# Altium schematic sheet Converter_Unit.SchDoc
size A3
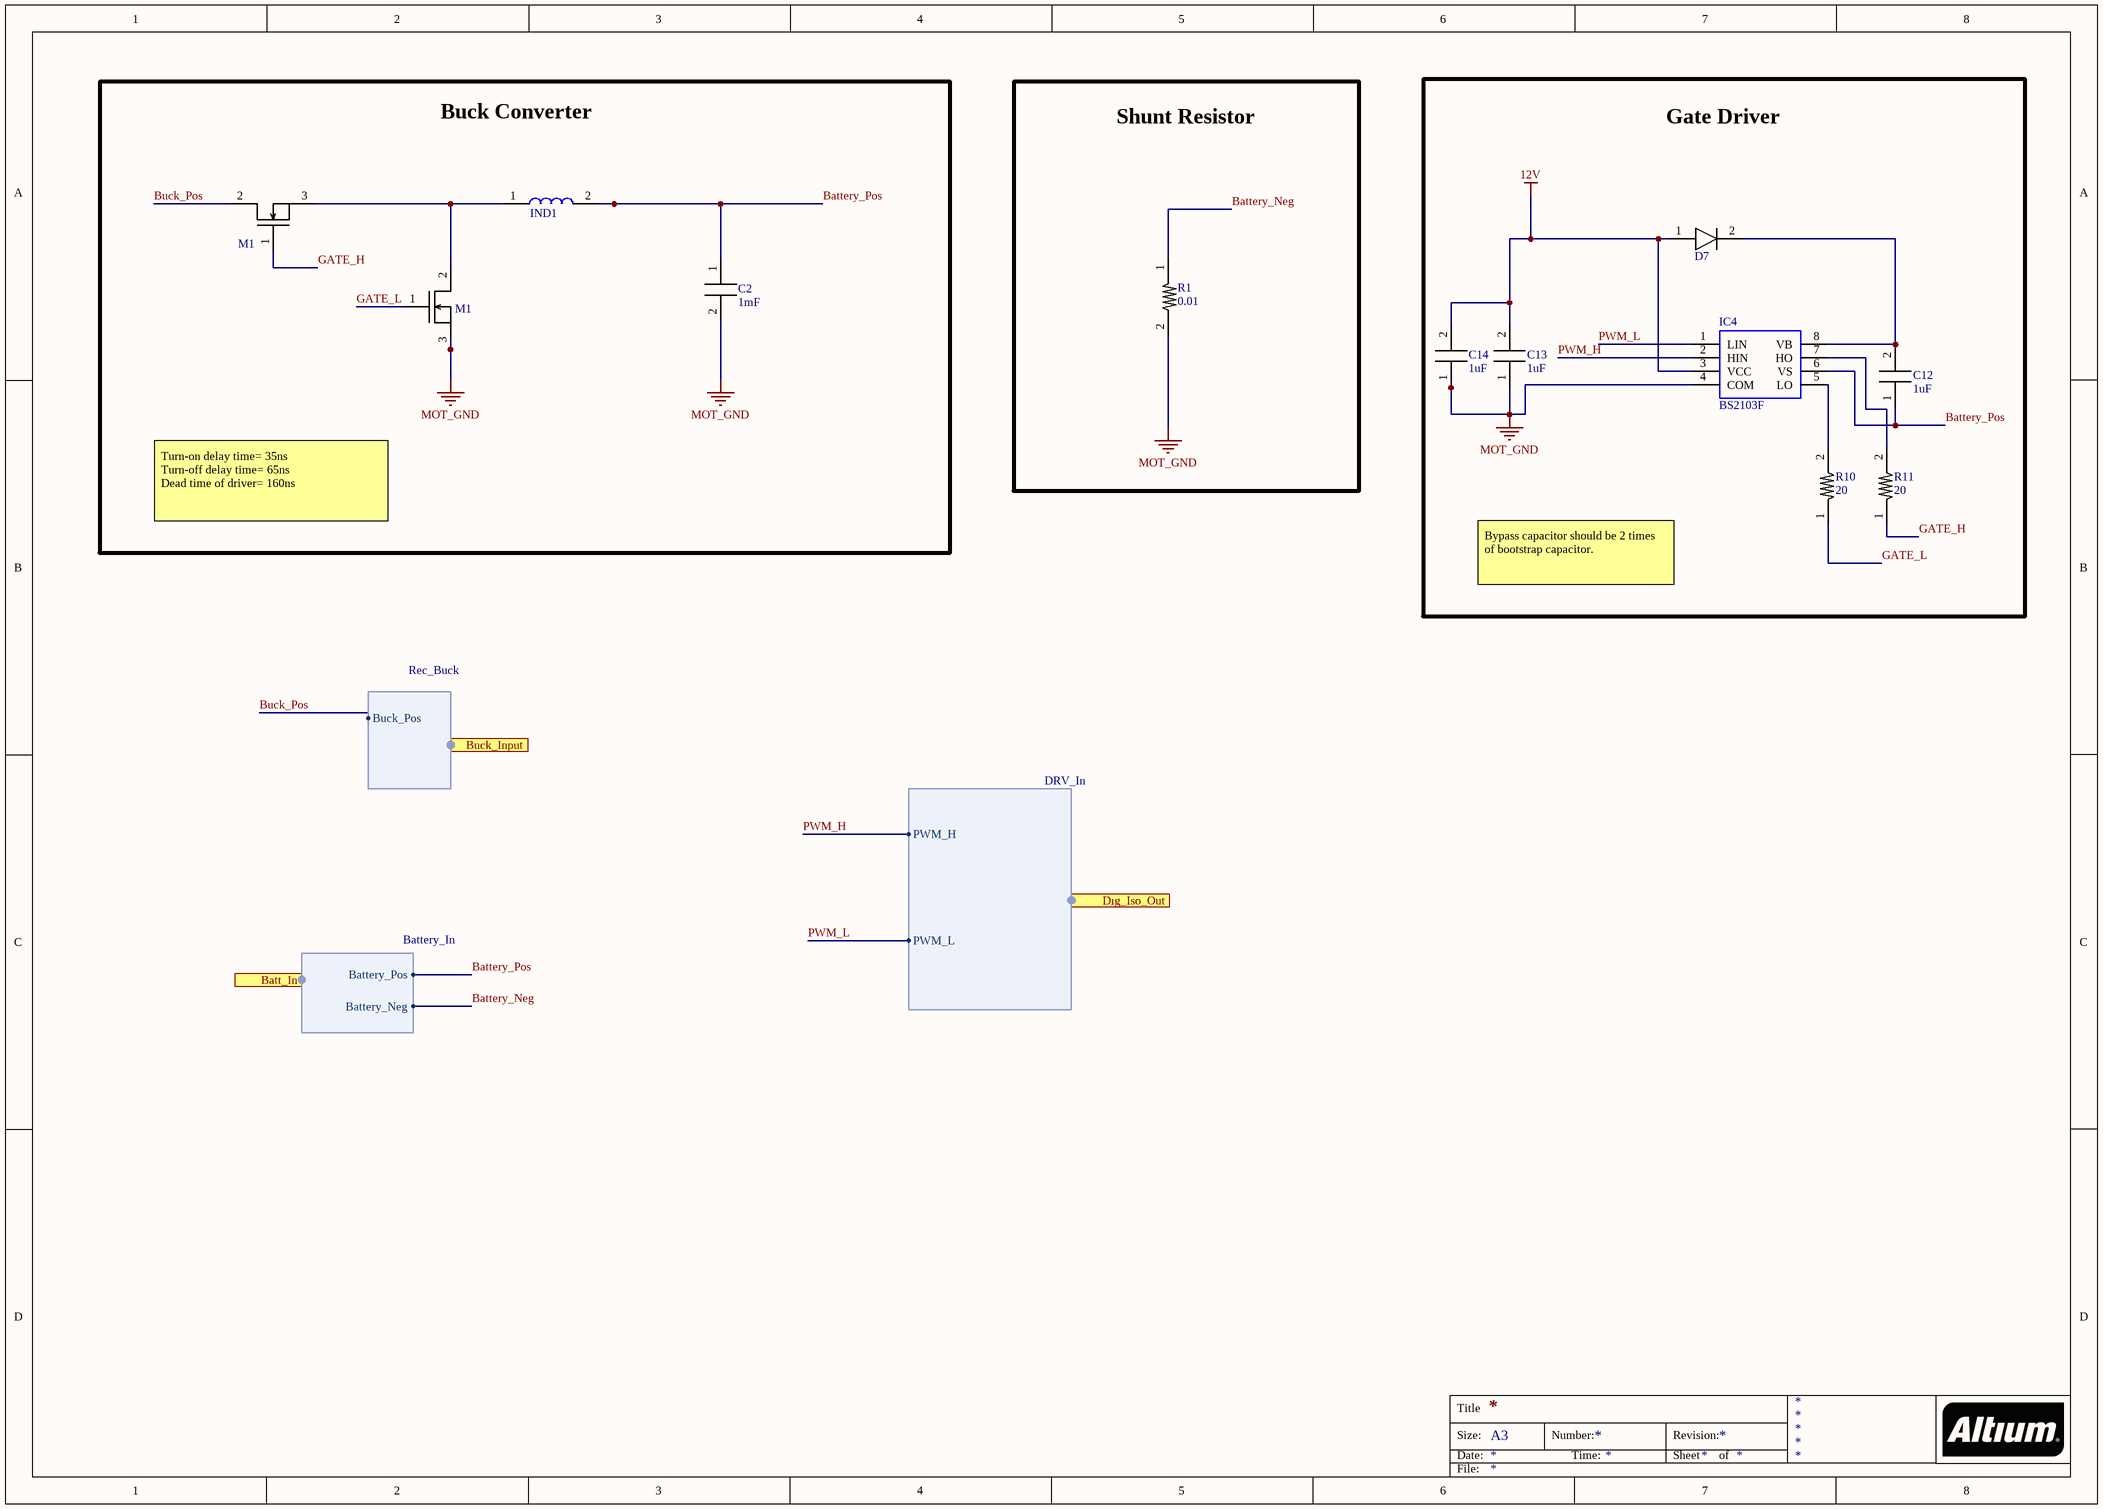
[diagram p0: Converter_Unit.SchDoc]

## Parts
*  M1
*?  M1
C2  Parameter 1: 1mF  (hidden comment: CAP 1mF UVK1V102MHD)
C12  Parameter 1: 1uF  (hidden comment: CAP 1uF)
C13  Parameter 1: 1uF  (hidden comment: CAP 1uF)
C14  Parameter 1: 1uF  (hidden comment: CAP 1uF)
D7  DI VS-10BQ030-M3/5BT  (value not drawn)
IC4  BS2103F  [BS2103F]
IND1  IND, 5mH, B82615B2202M001  (value not drawn)
R1  Parameter 1: 0.01  (hidden comment: RES, 0.01, 0402, Shunt)
R10  Parameter 1: 20  (hidden comment: RES, 20, 0603)
R11  Parameter 1: 20  (hidden comment: RES, 20, 0603)

## Ports
Batt_In (harness Battery_In), Buck_Input (harness Rec_Buck), Dıg_Iso_Out (harness DRV_In)

## Harnesses
Rec_Buck: Buck_Pos
Battery_In: Battery_Pos, Battery_Neg
DRV_In: PWM_H, PWM_L

## Nets
12V: C13.2 C14.2 D7.1(Anode) IC4.3(VCC)
MOT_GND: *?.3 C2.2 C13.1 C14.1 IC4.4(COM) R1.2
Battery_Neg: R1.1 ; port Batt_In.Battery_Neg
Battery_Pos: C2.1 C12.1 IC4.6(VS) IND1.2 ; port Batt_In.Battery_Pos
Buck_Pos: *.2 ; harness Rec_Buck.Buck_Pos
GATE_H: *.1 R11.1
GATE_L: *?.1 R10.1
PWM_H: IC4.2(HIN) ; port Dıg_Iso_Out.PWM_H
PWM_L: IC4.1(LIN) ; port Dıg_Iso_Out.PWM_L
Net*_3: *.3 *?.2 IND1.1
NetC12_2: C12.2 D7.2(Cathode) IC4.8(VB)
NetIC4_5: IC4.5(LO) R10.2
NetIC4_7: IC4.7(HO) R11.2

## Notes on the sheet
- Buck Converter
- Shunt Resistor
- Gate Driver
- Turn-on delay time= 35ns
  Turn-off delay time= 65ns
  Dead time of driver= 160ns
- Bypass capacitor should be 2 times of bootstrap capacitor.
- Title
- Size:
- Date:
- A3
- Number:
- Time:
- Revision:
- Sheet
- of
- File:

## Library data of the parts
* *? = MOS, N-CH, FDD5N550NZ: MOS, N-CH, FDD5N550NZ, 2A
C2 = CAP 1mF UVK1V102MHD: CAP, ELC, 1mF, UVK1V102MHD, 35V
D7 = DI VS-10BQ030-M3/5BT: 30V, 2A, SCHOTTKY
IC4 = IC DRV, HALF-B, BS2103F
IND1 = IND, 5mH, B82615B2202M001: IND, 5mH, B82615B2202M001, 250V, 2A
R1 = RES, 0.01, 0402, Shunt: RES, 0.01, 0402, Shunt, CSS0402FT10L0